# EAGLE schematic controller-main_old (EAGLE 8.4.0)
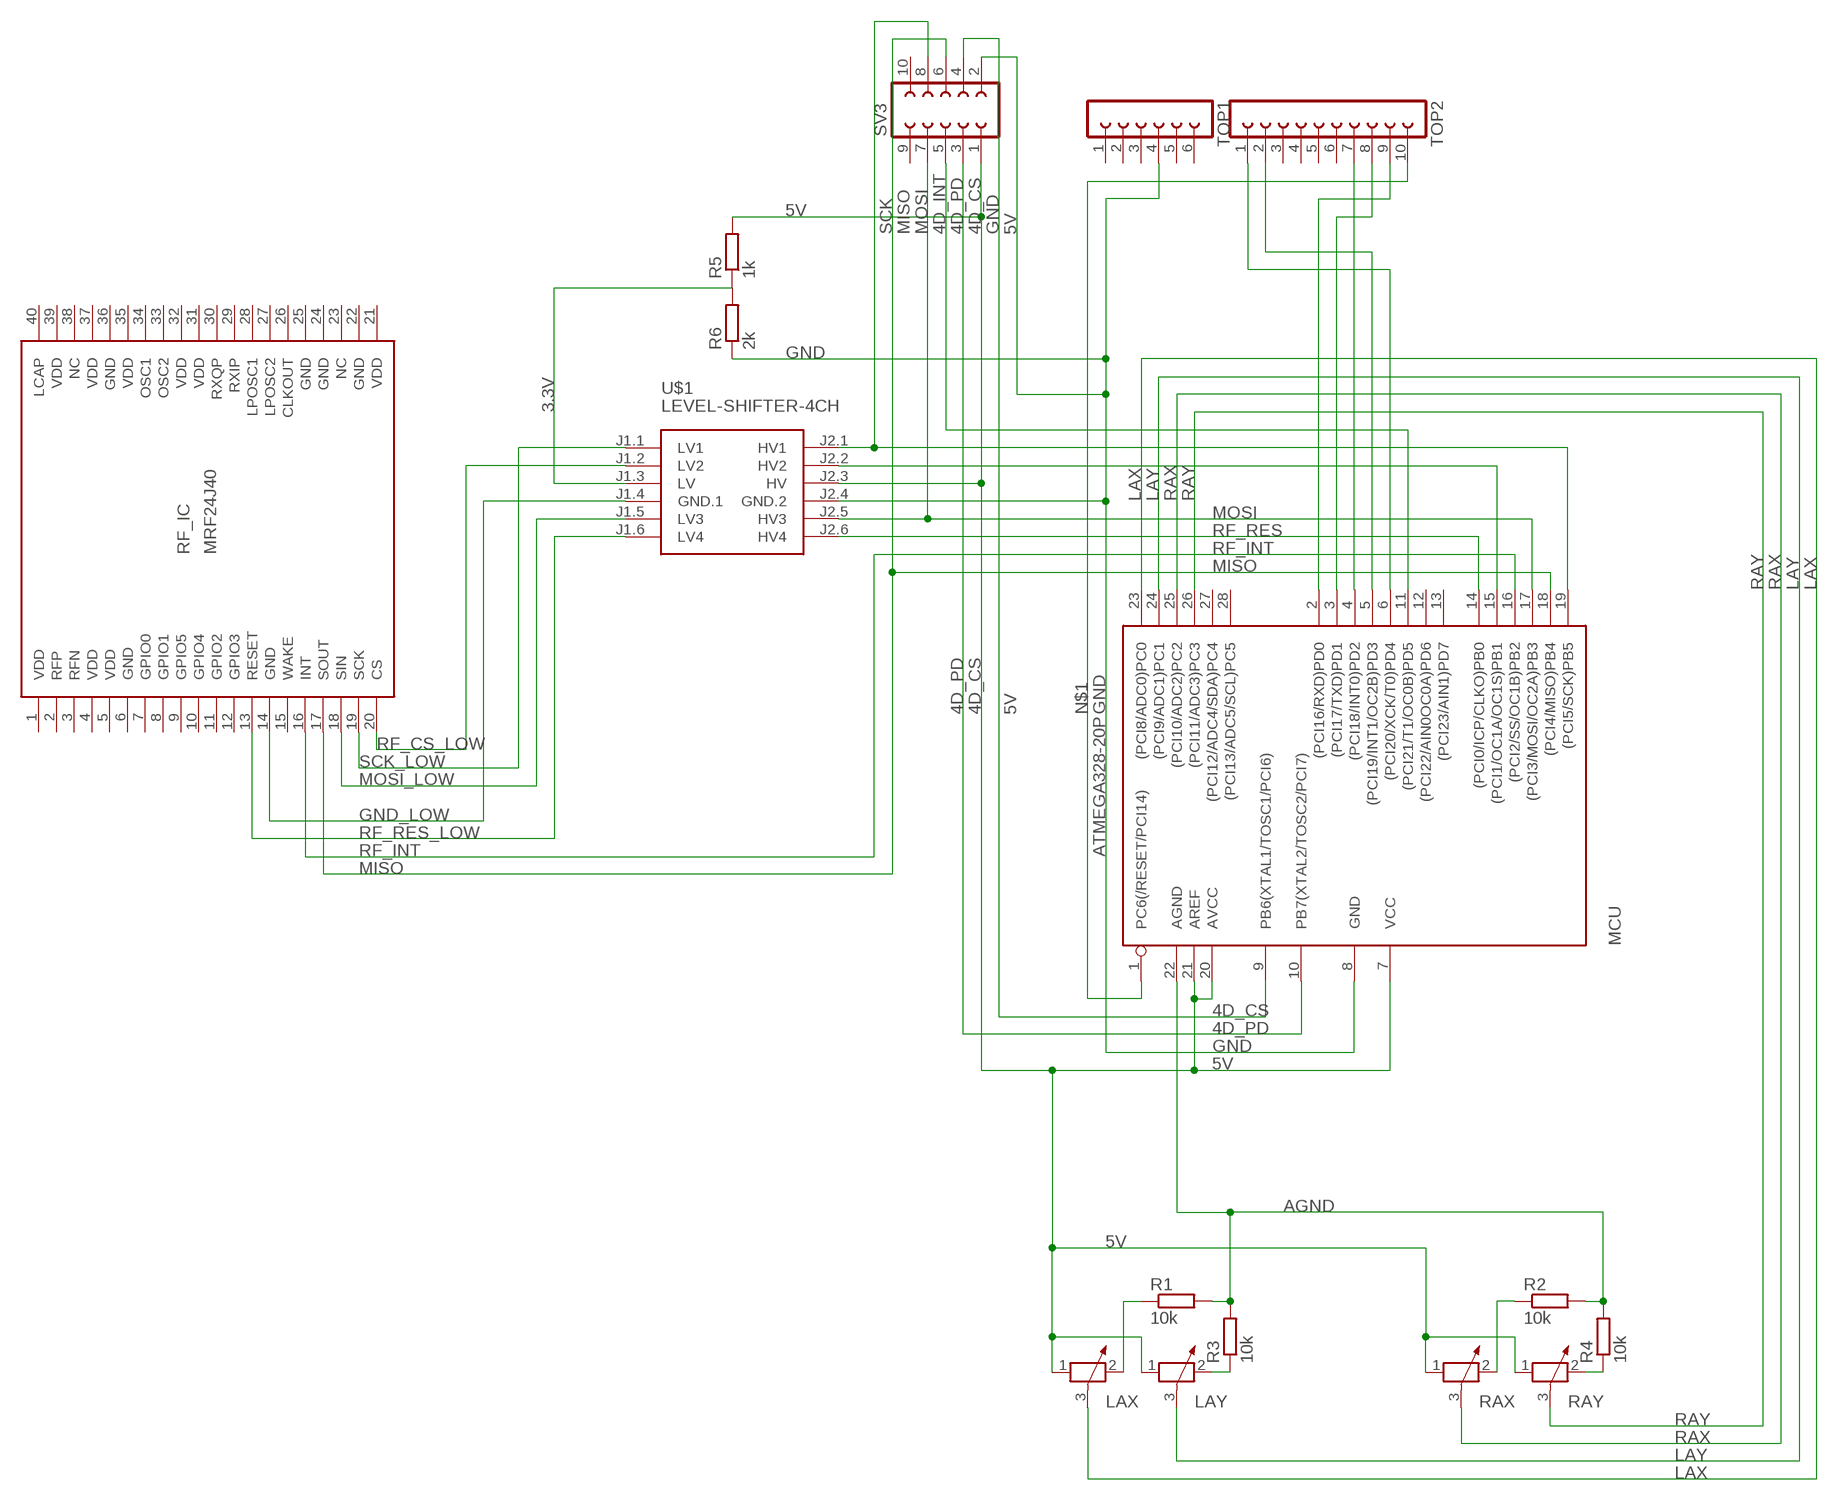
[diagram p0: schematic, sheet 1]

## Parts
LAX  POTENTIOMETER_PT-10S  [PT-10S]
LAY  POTENTIOMETER_PT-10S  [PT-10S]
MCU  ATMEGA328-20P  [DIL28-3]
R1  10k  R-EU_0204/5  [0204/5]
R2  10k  R-EU_0204/5  [0204/5]
R3  10k  R-EU_0204/5  [0204/5]
R4  10k  R-EU_0204/5  [0204/5]
R5  1k  R-EU_0204/5  [0204/5]
R6  2k  R-EU_0204/5  [0204/5]
RAX  POTENTIOMETER_PT-10S  [PT-10S]
RAY  POTENTIOMETER_PT-10S  [PT-10S]
RF_IC  MRF24J40  [QFN40ML6X6MM]
SV3  FE05-2W  [FE05-2W]
TOP1  FE06W  [FE06W]
TOP2  FE10W  [FE10W]
U$1  LEVEL-SHIFTER-4CH  [LEVEL-SHIFTER-4CH]

## Nets
3.3V: R5.1 U$1.J1.3(LV)
4D_CS: MCU.9(PB6(XTAL1/TOSC1/PCI6)) SV3.4
4D_INT: MCU.11((PCI21/T1/OC0B)PD5) SV3.5
4D_PD: MCU.10(PB7(XTAL2/TOSC2/PCI7)) SV3.3
5V: LAX.1 LAY.1 MCU.7(VCC) MCU.20(AVCC) MCU.21(AREF) R5.2 RAX.1 RAY.1 SV3.1 U$1.J2.3(HV)
AGND: MCU.22(AGND) R1.2 R2.2 R3.2 R4.2
AGND1: LAX.2 R1.1
AGND2: R2.1 RAX.2
GND: MCU.8(GND) R6.1 SV3.2 TOP1.4 U$1.J2.4(GND.2)
GND_LOW: RF_IC.14(GND) U$1.J1.4(GND.1)
LAX: LAX.3 MCU.23((PCI8/ADC0)PC0)
LAY: LAY.3 MCU.24((PCI9/ADC1)PC1)
MISO: MCU.18((PCI4/MISO)PB4) RF_IC.17(SOUT) SV3.6
MOSI: MCU.17((PCI3/MOSI/OC2A)PB3) SV3.7 U$1.J2.5(HV3)
MOSI_LOW: RF_IC.18(SIN) U$1.J1.5(LV3)
N$1: MCU.1(PC6(/RESET/PCI14)) TOP2.10
N$2: MCU.6((PCI20/XCK/T0)PD4) TOP2.1
N$3: MCU.5((PCI19/INT1/OC2B)PD3) TOP2.2
N$4: MCU.2((PCI16/RXD)PD0) TOP2.9
N$5: MCU.3((PCI17/TXD)PD1) TOP2.8
N$6: MCU.4((PCI18/INT0)PD2) TOP2.7
N$12: LAY.2 R3.1
N$16: R4.1 RAY.2
RAX: MCU.25((PCI10/ADC2)PC2) RAX.3
RAY: MCU.26((PCI11/ADC3)PC3) RAY.3
RF_CS: MCU.15((PCI1/OC1A/OC1S)PB1) U$1.J2.2(HV2)
RF_CS_LOW: RF_IC.20(CS) U$1.J1.2(LV2)
RF_INT: MCU.16((PCI2/SS/OC1B)PB2) RF_IC.16(INT)
RF_RES: MCU.14((PCI0/ICP/CLKO)PB0) U$1.J2.6(HV4)
RF_RES_LOW: RF_IC.13(RESET) U$1.J1.6(LV4)
SCK: MCU.19((PCI5/SCK)PB5) SV3.8 U$1.J2.1(HV1)
SCK_LOW: RF_IC.19(SCK) U$1.J1.1(LV1)
Unconnected: MCU.12((PCI22/AIN0OC0A)PD6) MCU.13((PCI23/AIN1)PD7) MCU.27((PCI12/ADC4/SDA)PC4) MCU.28((PCI13/ADC5/SCL)PC5) R6.2 RF_IC.2(RFP) RF_IC.3(RFN) RF_IC.7(GPIO0) RF_IC.8(GPIO1) RF_IC.9(GPIO5) RF_IC.10(GPIO4) RF_IC.11(GPIO2) RF_IC.12(GPIO3) RF_IC.15(WAKE) RF_IC.23(NC) RF_IC.26(CLKOUT) RF_IC.27(LPOSC2) RF_IC.28(LPOSC1) RF_IC.29(RXIP) RF_IC.30(RXQP) RF_IC.33(OSC2) RF_IC.34(OSC1) RF_IC.38(NC) RF_IC.40(LCAP) SV3.9 SV3.10 TOP1.1 TOP1.2 TOP1.3 TOP1.5 TOP1.6 TOP2.3 TOP2.4 TOP2.5 TOP2.6

## Power pins joined to a net without a drawn wire
GND: RF_IC.6(GND) RF_IC.22(GND) RF_IC.24(GND) RF_IC.25(GND) RF_IC.36(GND)
VDD: RF_IC.1(VDD) RF_IC.4(VDD) RF_IC.5(VDD) RF_IC.21(VDD) RF_IC.31(VDD) RF_IC.32(VDD) RF_IC.35(VDD) RF_IC.37(VDD) RF_IC.39(VDD)

## Library data of the parts
LAX LAY RAX RAY = rcl:POTENTIOMETER_: Potentiometer
MCU = atmega328p:ATMEGA328*P: MICROCONTROLLER 32 kBytes FLASH 2 kBytes SRAM 1 kBytes EEPROM USART 8-channel 10 bit ADC
R1-R6 = rcl:R-EU_: RESISTOR, European symbol
RF_IC = microchip:MRF24J40: IEEE 802.15.4? 2.4 GHz RF Transceiver Source: http://ww1.microchip.com/downloads/en/DeviceDoc/39776a.pdf; MPN: MRF24J40-I/ML; OC_FARNELL: 1436019; OC_NEWARK: 17M0699
SV3 = con-lsta:FE05-2W: FEMALE HEADER; OC_FARNELL: unknown; OC_NEWARK: unknown
TOP1 = con-lsta:FE06W: FEMALE HEADER; OC_FARNELL: unknown; OC_NEWARK: unknown
TOP2 = con-lsta:FE10W: FEMALE HEADER; OC_FARNELL: unknown; OC_NEWARK: unknown
U$1 = diy-modules:LEVEL-SHIFTER-4CH: 4-Channel Bi-Directional Logic Level Converter based on BSS128 transistors Click here to find device on ebay.com <http://www.ebay.com/sch/i2c+logic+converter+module>